# Altium project SBC5.PrjPcb (part 4 of 6)

## Sheet USB.SchDoc
size C; DocumentNumber: 6; SheetNumber: 6; SheetTotal: 13
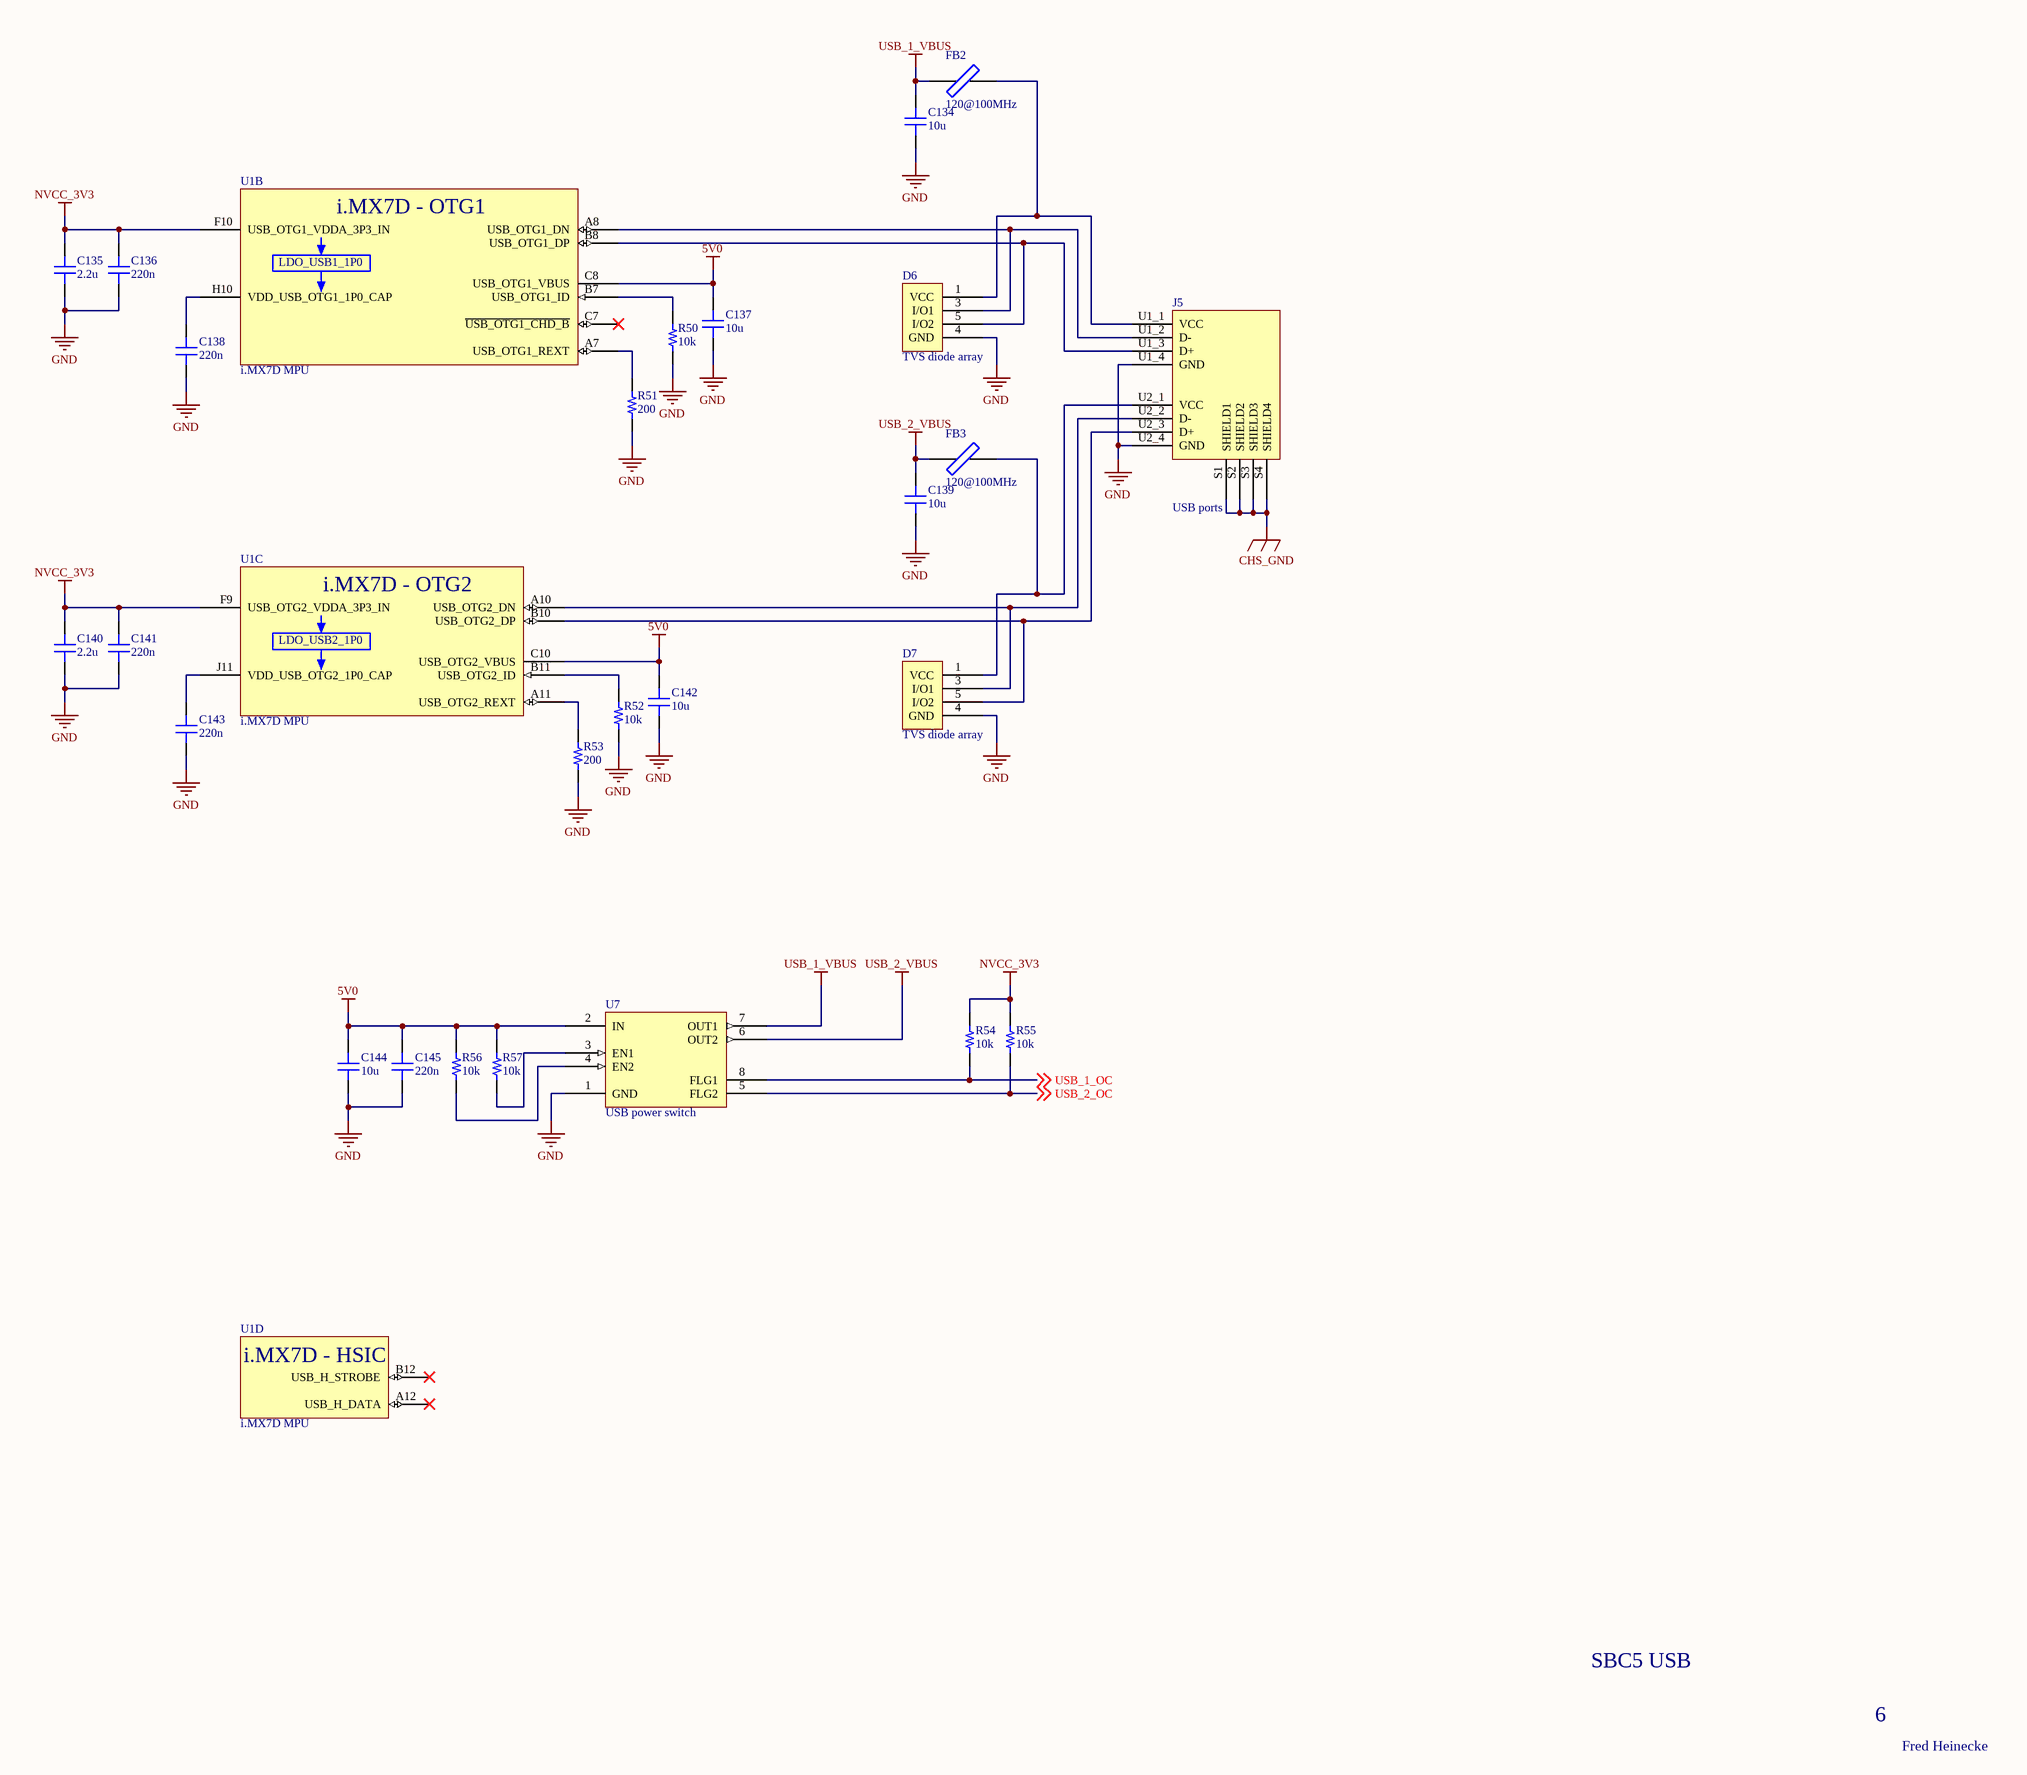
[diagram p8: USB.SchDoc]

### Parts
C134  10u  [C0805]
C135  2.2u  [C0402]
C136  220n  [C0201]
C137  10u  [C0805]
C138  220n  [C0201]
C139  10u  [C0805]
C140  2.2u  [C0402]
C141  220n  [C0201]
C142  10u  [C0805]
C143  220n  [C0201]
C144  10u  [C0805]
C145  220n  [C0201]
D6  TVS diode array  [TPD2E001DRLR]
D7  TVS diode array  [TPD2E001DRLR]
FB2  120@100MHz  [L0402]
FB3  120@100MHz  [L0402]
J5  USB ports  [UJ2-ADH-1-TH]
R50  10k  [R0201]
R51  200  [R0402]
R52  10k  [R0201]
R53  200  [R0402]
R54  10k  [R0201]
R55  10k  [R0201]
R56  10k  [R0201]
R57  10k  [R0201]
U1  i.MX7D MPU  [BGA541C75P25X25_1900X1900X140]  (parts B,C,D of 23)
U7  USB power switch  [SO-8]

### Nets
5V0: C137.2 C142.2 C144.2 C145.2 R56.2 R57.2 U1.C8(USB_OTG1_VBUS) U1.C10(USB_OTG2_VBUS) U7.2(IN)
CHS_GND: J5.S1(SHIELD1) J5.S2(SHIELD2) J5.S3(SHIELD3) J5.S4(SHIELD4)
GND: C134.1 C135.1 C136.1 C137.1 C138.1 C139.1 C140.1 C141.1 C142.1 C143.1 C144.1 C145.1 D6.4(GND) D7.4(GND) J5.U1_4(GND) J5.U2_4(GND) R50.1 R51.1 R52.1 R53.1 U7.1(GND)
NVCC_3V3: C135.2 C136.2 C140.2 C141.2 R54.2 R55.2 U1.F9(USB_OTG2_VDDA_3P3_IN) U1.F10(USB_OTG1_VDDA_3P3_IN)
USB_1_VBUS: C134.2 FB2.1 U7.7(OUT1)
USB_2_VBUS: C139.2 FB3.1 U7.6(OUT2)
USB_1_OC: R54.1 U7.8(FLG1) ; off-sheet USB_1_OC
USB_2_OC: R55.1 U7.5(FLG2) ; off-sheet USB_2_OC
NetC138_2: C138.2 U1.H10(VDD_USB_OTG1_1P0_CAP)
NetC143_2: C143.2 U1.J11(VDD_USB_OTG2_1P0_CAP)
NetD6_1: D6.1(VCC) FB2.2 J5.U1_1(VCC)
NetD6_3: D6.3(I/O1) J5.U1_2(D-) U1.A8(USB_OTG1_DN)
NetD6_5: D6.5(I/O2) J5.U1_3(D+) U1.B8(USB_OTG1_DP)
NetD7_1: D7.1(VCC) FB3.2 J5.U2_1(VCC)
NetD7_3: D7.3(I/O1) J5.U2_2(D-) U1.A10(USB_OTG2_DN)
NetD7_5: D7.5(I/O2) J5.U2_3(D+) U1.B10(USB_OTG2_DP)
NetR50_2: R50.2 U1.B7(USB_OTG1_ID)
NetR51_2: R51.2 U1.A7(USB_OTG1_REXT)
NetR52_2: R52.2 U1.B11(USB_OTG2_ID)
NetR53_2: R53.2 U1.A11(USB_OTG2_REXT)
NetR56_1: R56.1 U7.4(EN2)
NetR57_1: R57.1 U7.3(EN1)

Not connected (* = marked no-connect by the designer): U1 A12(USB_H_DATA)* B12(USB_H_STROBE)* C7(~{USB_OTG1_CHD_B})*

### Notes on the sheet
- SBC5 USB
- 6
- Fred Heinecke
- (in symbol MCIMX7D2DVM12SD, part B) i.MX7D - OTG1; LDO_USB1_1P0
- (in symbol MCIMX7D2DVM12SD, part C) i.MX7D - OTG2; LDO_USB2_1P0
- (in symbol MCIMX7D2DVM12SD, part D) i.MX7D - HSIC

### Library data of the parts
C134 C137 C139 C142 C144 = CL21A106KOQNNNE: SAMSUNG ELECTRO-MECHANICS - CL21A106KOQNNNE - SMD Multilayer Ceramic Capacitor, 10 µF, 16 V, 0805 [2012 Metric], ± 10%, X5R, CL Series; Capacitance: 10uF; Voltage Rating: 16V; Dielectric: X7R; Supplier 1: Digi-Key; Supplier Part Number 1: 1276-1096-1-ND; Manufacturer: Samsung; Manufacturer Part Number: CL21A106KOQNNNE; RoHS: Yes; Category: Ceramic Capacitors; Stock 1: 1393610; Pricing 1: 1=0.12000, 10=0.09000, 50=0.04900, 100=0.04000, 500=0.02860, 1000=0.02248 (USD); Mount: Surface Mount; Case/Package: 0805; Case Code (Metric): 2012; Case Code (Imperial): 0805; Min Operating Temperature: -55°C; Max Operating Temperature: 85°C; Package Quantity: 1; Packaging: Tape and Reel; Tolerance: 10%; Voltage Rating (DC): 16V; Series: CL; Construction: Flat; Voltage: 16V; Length: 2mm; Width: 0.049inch; Height: 1.25mm; Thickness: 0.055inch; Depth: 1.25mm; Radiation Hardening: No; Lead Free: Lead Free; RoHS Compliant: Yes; ComponentLink1URL: https://datasheet.ciiva.com/15216/getdatasheetpartid-358435-15216234.pdf?src-supplier=Verical; ComponentLink1Description: https://datasheet.ciiva.com/15216/getdatasheetpartid-358435-15216234.pdf?src-supplier=Verical; ComponentLink2URL: https://datasheet.ciiva.com/25798/cl21a106koqnnne-25798133.pdf?src-supplier=Digi-Key; ComponentLink2Description: https://datasheet.ciiva.com/25798/cl21a106koqnnne-25798133.pdf?src-supplier=Digi-Key; ComponentLink3URL: https://datasheet.ciiva.com/16740/cl05b104kq5nnnc-16740697.pdf?src-supplier=Future+Electronics; ComponentLink3Description: https://datasheet.ciiva.com/16740/cl05b104kq5nnnc-16740697.pdf?src-supplier=Future+Electronics
C135 C140 = LMK105BJ225MV-F: TAIYO YUDEN         LMK105BJ225MV-F            CERAMIC CAPACITOR, 2.2UF, 10V, X5R, 20%, 0402; Supplier 1: Digi-Key; Manufacturer: Taiyo Yuden; Manufacturer Part Number: LMK105BJ225MV-F; RoHS: Yes; Category: Ceramic Capacitors; Stock 1: 422093; Pricing 1: 1=0.10000, 10=0.05800, 50=0.03160, 100=0.02590, 500=0.01848, 1000=0.01452, 2500=0.01320, 5000=0.01214 (USD); Mount: Surface Mount; Case/Package: 0402; Case Code (Imperial): 0402; Case Code (Metric): 1005; Min Operating Temperature: -55°C; Max Operating Temperature: 85°C; Termination: SMD/SMT; Packaging: Tape and Reel; Capacitance: 2.2uF; Tolerance: 20%; Voltage Rating: 10V; Package Quantity: 1; Voltage Rating (DC): 10V; Dielectric: X5R; Resistor Type: Ceramic; Length: 1mm; Width: 0.5mm; Height: 0.5mm; Thickness: 0.022inch; Depth: 0.5mm; Radiation Hardening: No; Halogen Free: Halogen Free; REACH SVHC: Unknown; ComponentLink1URL: https://datasheet.ciiva.com/30190/500lmk105bj225mv-f-30190498.pdf?src-supplier=Onlinecomponents.com; ComponentLink1Description: https://datasheet.ciiva.com/30190/500lmk105bj225mv-f-30190498.pdf?src-supplier=Onlinecomponents.com; ComponentLink2URL: https://datasheet.ciiva.com/23631/lmk105bj225mv-f-ss-23631491.pdf?src-supplier=Newark; ComponentLink2Description: https://datasheet.ciiva.com/23631/lmk105bj225mv-f-ss-23631491.pdf?src-supplier=Newark; ComponentLink3URL: https://datasheet.ciiva.com/134/lmk105bj225mv-f-ss-134677.pdf?src-supplier=Digi-Key; ComponentLink3Description: https://datasheet.ciiva.com/134/lmk105bj225mv-f-ss-134677.pdf?src-supplier=Digi-Key; ComponentLink4URL: https://datasheet.ciiva.com/15921/286lmk105bj225mv-f-15921222.pdf?src-supplier=Onlinecomponents.com; ComponentLink4Description: https://datasheet.ciiva.com/15921/286lmk105bj225mv-f-15921222.pdf?src-supplier=Onlinecomponents.com; Supplier Part Number 1: 587-3153-1-ND
C136 C138 C141 C143 C145 = GRM033R61C224KE14D: Cap Ceramic Monolithic 0.22uF 16VDC 10% SMD Paper T/R; Manufacturer: Murata; Supplier 1: Digi-Key; Manufacturer Part Number: GRM033R61C224KE14D; RoHS: No; Stock 1: 16192; Pricing 1: 1=0.10000, 10=0.03900, 50=0.02120, 100=0.01720, 500=0.01232, 1000=0.00968, 2500=0.00880, 5000=0.00810 (USD); ComponentLink1URL: https://search.murata.co.jp/Ceramy/image/img/A01X/G101/ENG/GRM033R61C224KE14-01.pdf?src-supplier=Digi-Key; ComponentLink1Description: https://search.murata.co.jp/Ceramy/image/img/A01X/G101/ENG/GRM033R61C224KE14-01.pdf?src-supplier=Digi-Key; Supplier Part Number 1: 490-17040-1-ND
D6 D7 = TPD2E001DRLR: TEXAS INSTRUMENTS - TPD2E001DRLR - ESD Protection Device, 105.5 V, SOT, 5 Pins, 5.5 V, TPD2E Series; Direction: Unidirectional; Capacitance: 1.5pF; Number of Channels: 2; Breakdown Voltage: 11V; Clamping Voltage: 105.5V; Reverse Standoff Voltage: 5.5V; Power Line Protection: Yes; Leakage Current: 1nA; Element Configuration: Dual; Interface: LVDS,USB,Ethernet; Min Supply Voltage: 900mV; Peak Pulse Current: 10A; Supplier 1: Digi-Key; Supplier Part Number 1: 296-21883-1-ND; Manufacturer: Texas Instruments; Manufacturer Part Number: TPD2E001DRLR; RoHS: Yes; Category: Interface ICs; Stock 1: 42050; Pricing 1: 1=0.56000, 10=0.47900, 100=0.33280, 500=0.26880 (USD); Case/Package: SOT; Number of Pins: 5; Weight: 9.9E-05oz; Contact Plating: Gold; Min Operating Temperature: -40°C; Max Operating Temperature: 85°C; Package Quantity: 1; Polarity: Unidirectional; Packaging: Tape and Reel; Number of Bidirectional Channels: 2; Min Breakdown Voltage: 11V; Max Supply Voltage: 5.5V; Termination: SMD/SMT; Working Voltage: 5.5V; Length: 1.6mm; Width: 1.2mm; Height: 0.55mm; Depth: 1.2mm; Radiation Hardening: No; Lead Free: Lead Free; REACH SVHC: No SVHC; ComponentLink1URL: https://datasheet.ciiva.com/4479/slls684f-121568-4479427.pdf?src-supplier=Mouser; ComponentLink1Description: https://datasheet.ciiva.com/4479/slls684f-121568-4479427.pdf?src-supplier=Mouser; ComponentLink2URL: https://datasheet.ciiva.com/15134/getdatasheetpartid-186217-15134447.pdf?src-supplier=Verical; ComponentLink2Description: https://datasheet.ciiva.com/15134/getdatasheetpartid-186217-15134447.pdf?src-supplier=Verical; ComponentLink3URL: https://datasheet.ciiva.com/25955/tpd2e001-25955782.pdf?src-supplier=Avnet+Europe; ComponentLink3Description: https://datasheet.ciiva.com/25955/tpd2e001-25955782.pdf?src-supplier=Avnet+Europe; ComponentLink4URL: https://datasheet.ciiva.com/338/tpd2e001-338329.pdf?src-supplier=Digi-Key; ComponentLink4Description: https://datasheet.ciiva.com/338/tpd2e001-338329.pdf?src-supplier=Digi-Key; ComponentLink5URL: https://datasheet.ciiva.com/7650/1851973-7650906.pdf?src-supplier=Element14; ComponentLink5Description: https://datasheet.ciiva.com/7650/1851973-7650906.pdf?src-supplier=Element14; ComponentLink6URL: https://datasheet.ciiva.com/14423/tpd2e001-14423679.pdf?src-supplier=Avnet; ComponentLink6Description: https://datasheet.ciiva.com/14423/tpd2e001-14423679.pdf?src-supplier=Avnet; ComponentLink7URL: https://datasheet.ciiva.com/16476/tpd2e001-16476822.pdf?src-supplier=Avnet+Asia; ComponentLink7Description: https://datasheet.ciiva.com/16476/tpd2e001-16476822.pdf?src-supplier=Avnet+Asia; ComponentLink8URL: https://datasheet.ciiva.com/338/tpd2e001-338328.pdf?src-supplier=Digi-Key; ComponentLink8Description: https://datasheet.ciiva.com/338/tpd2e001-338328.pdf?src-supplier=Digi-Key; ComponentLink9URL: https://datasheet.ciiva.com/338/tpd2e001-338330.pdf?src-supplier=Digi-Key; ComponentLink9Description: https://datasheet.ciiva.com/338/tpd2e001-338330.pdf?src-supplier=Digi-Key; Supplier 2: Arrow Electronics; Supplier Part Number 2: TPD2E001DRLR; Supplier 3: Mouser; Supplier Part Number 3: 595-TPD2E001DRLR
FB2 FB3 = BLM15PD121SN1D: MURATA - BLM15PD121SN1D - Ferrite Bead, 0402 [1005 Metric], 120 ohm, 1.3 A, BLM15PD Series, 0.09 ohm, ± 25%; Material: Steel,Ferrite; Impedance: 120R; DC Resistance (DCR): 90mR; Max DC Current: 1.3A; Number of Lines: 1; Test Frequency: 100MHz; Supplier 1: Digi-Key; Supplier Part Number 1: 490-5203-1-ND; Manufacturer: Murata; Manufacturer Part Number: BLM15PD121SN1D; RoHS: Yes; Category: Inductors; Stock 1: 519984; Pricing 1: 1=0.10000, 10=0.07900, 25=0.07080, 50=0.05180, 100=0.04480, 250=0.03536, 500=0.02984, 1000=0.02514, 5000=0.02239 (USD); Case/Package: 0402; Number of Pins: 2; Core Material: Ferrite; Case Code (Metric): 1005; Case Code (Imperial): 0402; Min Operating Temperature: -55°C; Max Operating Temperature: 125°C; Tolerance: 25%; Package Quantity: 1; Packaging: Tape and Reel; Current Rating: 1.3A; Max Current Rating: 1.3A; Termination: SMD/SMT; DC Current: 1.3A; Number of Circuits: 1; Series: BLM15PD; DC Resistance-Max: 90mR; Length: 1mm; Width: 0.5mm; Height: 0.5mm; Depth: 0.55mm; Radiation Hardening: No; REACH SVHC: No SVHC; Military Standard: Not; Lead Free: Lead Free; RoHS Compliant: Yes; ComponentLink1URL: https://datasheet.ciiva.com/18093/getdatasheetpartid-195858-18093157.pdf?src-supplier=Verical; ComponentLink1Description: https://datasheet.ciiva.com/18093/getdatasheetpartid-195858-18093157.pdf?src-supplier=Verical; ComponentLink2URL: https://datasheet.ciiva.com/11800/0900766b811b5866-11800860.pdf?src-supplier=RSComponents; ComponentLink2Description: https://datasheet.ciiva.com/11800/0900766b811b5866-11800860.pdf?src-supplier=RSComponents; ComponentLink3URL: https://datasheet.ciiva.com/41425/001171686-da-01-en-chip-drossel0402-120r-1300ma-1-0x0-5mm-41425776.pdf?src-supplier=Conrad; ComponentLink3Description: https://datasheet.ciiva.com/41425/001171686-da-01-en-chip-drossel0402-120r-1300ma-1-0x0-5mm-41425776.pdf?src-supplier=Conrad; ComponentLink4URL: https://datasheet.ciiva.com/41449/001172205-da-01-en-drossel-0402-120r-11-0x0-5mm-10000st-41449495.pdf?src-supplier=Conrad; ComponentLink4Description: https://datasheet.ciiva.com/41449/001172205-da-01-en-drossel-0402-120r-11-0x0-5mm-10000st-41449495.pdf?src-supplier=Conrad; ComponentLink5URL: https://datasheet.ciiva.com/1012/l0110e-1012434.pdf?src-supplier=Digi-Key; ComponentLink5Description: https://datasheet.ciiva.com/1012/l0110e-1012434.pdf?src-supplier=Digi-Key; ComponentLink6URL: https://datasheet.ciiva.com/1012/l0110e-1012435.pdf?src-supplier=Digi-Key; ComponentLink6Description: https://datasheet.ciiva.com/1012/l0110e-1012435.pdf?src-supplier=Digi-Key; ComponentLink7URL: https://datasheet.ciiva.com/1012/l0110e-1012436.pdf?src-supplier=Digi-Key; ComponentLink7Description: https://datasheet.ciiva.com/1012/l0110e-1012436.pdf?src-supplier=Digi-Key
J5 = UJ2-ADH-1-TH: CONN RCPT USB2.0 TYPEA STACK R/A; Manufacturer: CUI; Connector Type: Jack; Number of Contacts: 8; Gender: Receptacle; Supplier 1: Digi-Key; Supplier Part Number 1: 102-4001-ND; Manufacturer Part Number: UJ2-ADH-1-TH; RoHS: No; Category: Connectors; Stock 1: 1615; Pricing 1: 1=0.95000, 10=0.83100, 25=0.78240, 50=0.74980, 130=0.71723, 260=0.65200, 520=0.58681, 1040=0.52160, 2600=0.47270 (USD); Mount: Through Hole,Horizontal; Number of Pins: 8; Features: Shielded; Packaging: Tray; Orientation: Horizontal; Lead Free: Lead Free; ComponentLink1URL: https://www.cui.com/product/resource/digikeypdf/uj2-adh-th.pdf?src-supplier=Mouser; ComponentLink1Description: https://www.cui.com/product/resource/digikeypdf/uj2-adh-th.pdf?src-supplier=Mouser; ComponentLink2URL: https://www.cui.com/product/resource/digikeypdf/uj2-adh-th.pdf?src-supplier=Verical; ComponentLink2Description: https://www.cui.com/product/resource/digikeypdf/uj2-adh-th.pdf?src-supplier=Verical; ComponentLink3URL: https://www.cui.com/product/resource/digikeypdf/uj2-adh-th.pdf?src-supplier=Onlinecomponents.com; ComponentLink3Description: https://www.cui.com/product/resource/digikeypdf/uj2-adh-th.pdf?src-supplier=Onlinecomponents.com; ComponentLink4URL: https://www.cui.com/product/resource/digikeypdf/uj2-adh-th.pdf?src-supplier=Digi-Key; ComponentLink4Description: https://www.cui.com/product/resource/digikeypdf/uj2-adh-th.pdf?src-supplier=Digi-Key; ComponentLink5URL: https://www.cui.com/product/resource/digikeypdf/uj2-adh-th.pdf?src-supplier=Arrow+Electronics; ComponentLink5Description: https://www.cui.com/product/resource/digikeypdf/uj2-adh-th.pdf?src-supplier=Arrow+Electronics; ComponentLink6URL: https://www.cui.com/product/resource/digikeypdf/uj2-adh-th.pdf?src-supplier=Electro+Sonic; ComponentLink6Description: https://www.cui.com/product/resource/digikeypdf/uj2-adh-th.pdf?src-supplier=Electro+Sonic; ComponentLink7URL: https://www.cui.com/product/resource/digikeypdf/uj2-adh-th.pdf?src-supplier=NAC+Semi; ComponentLink7Description: https://www.cui.com/product/resource/digikeypdf/uj2-adh-th.pdf?src-supplier=NAC+Semi
R50 R52 R54-R57 = RMCF0201FT10K0: RES 10K OHM 1% 1/20W 0201; Manufacturer: Stackpole Electronics; Max Power Dissipation: 50mW; Temperature Coefficient: 200ppm/°C; Resistance: 10kR; Supplier 1: Digi-Key; Manufacturer Part Number: RMCF0201FT10K0; RoHS: Yes; Category: Chip SMD Resistors; Stock 1: 1526173; Pricing 1: 1=0.10000, 10=0.02300, 100=0.00940, 1000=0.00424, 2500=0.00368, 5000=0.00304 (USD); Mount: Surface Mount; Case/Package: 0201; Contact Plating: Tin,Matte; Case Code (Imperial): 0201; Case Code (Metric): 0603; Min Operating Temperature: -55°C; Max Operating Temperature: 125°C; Resistor Type: Thick Film; Number of Terminations: 2; Packaging: Tape and Reel; Tolerance: 1%; Power Rating: 50mW; Length: 0.024inch; Width: 0.012inch; Height: 0.009inch; ComponentLink1URL: https://www.seielect.com/catalog/SEI-Packaging.pdf?src-supplier=Digi-Key; ComponentLink1Description: https://www.seielect.com/catalog/SEI-Packaging.pdf?src-supplier=Digi-Key; ComponentLink2URL: https://www.seielect.com/Catalog/SEI-RMCF_RMCP.pdf?src-supplier=Avnet+Asia; ComponentLink2Description: https://www.seielect.com/Catalog/SEI-RMCF_RMCP.pdf?src-supplier=Avnet+Asia; ComponentLink3URL: https://www.seielect.com/Catalog/SEI-RMCF_RMCP.pdf?src-supplier=Avnet; ComponentLink3Description: https://www.seielect.com/Catalog/SEI-RMCF_RMCP.pdf?src-supplier=Avnet; ComponentLink4URL: https://www.seielect.com/Catalog/SEI-RMCF_RMCP.pdf?src-supplier=Digi-Key; ComponentLink4Description: https://www.seielect.com/Catalog/SEI-RMCF_RMCP.pdf?src-supplier=Digi-Key; Supplier Part Number 1: RMCF0201FT10K0CT-ND
R51 R53 = ERJ-2RKF2000X: Res Thick Film 0402 200 Ohm 1% 1/10W ±100ppm/°C Molded SMD Punched Carrier T/R; Manufacturer: Panasonic; Resistance: 200R; Power Rating: 100mW; Voltage Rating: 50V; Supplier 1: Digi-Key; Supplier Part Number 1: P200LCT-ND; Manufacturer Part Number: ERJ-2RKF2000X; RoHS: Yes; Category: Chip SMD Resistors; Stock 1: 1029432; Pricing 1: 1=0.10000, 10=0.02200, 100=0.00890, 1000=0.00398, 2500=0.00345, 5000=0.00285 (USD); Mount: Surface Mount; Case/Package: 0402; Case Code (Metric): 1005; Case Code (Imperial): 0402; Contact Plating: Tin; Size Code: 0402; Min Operating Temperature: -55°C; Max Operating Temperature: 155°C; Tolerance: 1%; Packaging: Tape and Reel; Package Quantity: 1; Resistor Type: Thick Film; Number of Terminations: 2; Termination: SMD/SMT; Temperature Coefficient: 100ppm/°C; Max Power Dissipation: 100mW; Voltage Rating (DC): 50V; Features: Automotive AEC-Q200; Series: ERJ; Technology: THICK FILM; Resistance Tolerance: 1%; Construction: Rectangular; Length: 1mm; Width: 0.02inch; Height: 0.35mm; Depth: 0.5mm; Radiation Hardening: No; REACH SVHC: No SVHC; Military Standard: Not; Lead Free: Lead Free; RoHS Compliant: Yes; ComponentLink1URL: https://datasheet.ciiva.com/11821/0900766b80f80784-11821222.pdf?src-supplier=RSComponents; ComponentLink1Description: https://datasheet.ciiva.com/11821/0900766b80f80784-11821222.pdf?src-supplier=RSComponents; ComponentLink2URL: https://datasheet.ciiva.com/16449/aoa0000ce2-16449365.pdf?src-supplier=Future+Electronics; ComponentLink2Description: https://datasheet.ciiva.com/16449/aoa0000ce2-16449365.pdf?src-supplier=Future+Electronics; ComponentLink3URL: https://datasheet.ciiva.com/48531/aoa0000ce2-48531061.pdf?src-supplier=Avnet; ComponentLink3Description: https://datasheet.ciiva.com/48531/aoa0000ce2-48531061.pdf?src-supplier=Avnet; ComponentLink4URL: https://datasheet.ciiva.com/22748/426256-22748294.pdf?src-supplier=Element14; ComponentLink4Description: https://datasheet.ciiva.com/22748/426256-22748294.pdf?src-supplier=Element14; ComponentLink5URL: https://datasheet.ciiva.com/28691/1678782-28691926.pdf?src-supplier=Element14; ComponentLink5Description: https://datasheet.ciiva.com/28691/1678782-28691926.pdf?src-supplier=Element14; ComponentLink6URL: https://datasheet.ciiva.com/6137/426256-6137544.pdf?src-supplier=Farnell; ComponentLink6Description: https://datasheet.ciiva.com/6137/426256-6137544.pdf?src-supplier=Farnell; ComponentLink7URL: https://datasheet.ciiva.com/22748/426256-22748296.pdf?src-supplier=Element14; ComponentLink7Description: https://datasheet.ciiva.com/22748/426256-22748296.pdf?src-supplier=Element14; ComponentLink8URL: https://datasheet.ciiva.com/43460/426256-43460283.pdf?src-supplier=Farnell; ComponentLink8Description: https://datasheet.ciiva.com/43460/426256-43460283.pdf?src-supplier=Farnell; ComponentLink9URL: https://datasheet.ciiva.com/24024/aoa0000ce2-24024252.pdf?src-supplier=Mouser; ComponentLink9Description: https://datasheet.ciiva.com/24024/aoa0000ce2-24024252.pdf?src-supplier=Mouser; ComponentLink10URL: https://datasheet.ciiva.com/9184/aoa0000ce2-9184574.pdf?src-supplier=Avnet; ComponentLink10Description: https://datasheet.ciiva.com/9184/aoa0000ce2-9184574.pdf?src-supplier=Avnet; ComponentLink11URL: https://datasheet.ciiva.com/16758/70260748-16758862.pdf?src-supplier=Allied+Electronics; ComponentLink11Description: https://datasheet.ciiva.com/16758/70260748-16758862.pdf?src-supplier=Allied+Electronics; ComponentLink12URL: https://datasheet.ciiva.com/22749/1678782-22749583.pdf?src-supplier=Element14; ComponentLink12Description: https://datasheet.ciiva.com/22749/1678782-22749583.pdf?src-supplier=Element14; ComponentLink13URL: https://datasheet.ciiva.com/30174/aoa0000ce2-30174431.pdf?src-supplier=Onlinecomponents.com; ComponentLink13Description: https://datasheet.ciiva.com/30174/aoa0000ce2-30174431.pdf?src-supplier=Onlinecomponents.com
U1 = MCIMX7D2DVM12SD: Heterogeneous Multicore Processing Architecture; Manufacturer: NXP Freescale; Manufacturer Part Number: MCIMX7D2DVM12SD; Stock 1: 0; Pricing 1: 168=18.42238 (USD); ComponentLink1Description: Datasheet; ComponentLink1URL: https://www.nxp.com/docs/en/data-sheet/IMX7DCEC.pdf; ComponentLink2Description: Reference manual; ComponentLink2URL: https://www.nxp.com/docs/en/reference-manual/IMX7DRM.pdf; ComponentLink3Description: Hardware Development Guide; ComponentLink3URL: https://www.nxp.com/docs/en/user-guide/IMX7DSHDG.pdf; Supplier 1: Digi-Key; Supplier Part Number 1: 568-15401-ND
U7 = AP2152SG-13: IC PWR SW USB 2CH 0.5A 8-SOIC; Manufacturer: Diodes; Number of Outputs: 2; Current Rating: 800mA; Max Supply Voltage: 5.5V; Min Supply Voltage: 2.7V; Interface: On/Off; Max Output Current: 500mA; On-State Resistance: 150mR; Fault Protection: Over Temperature,Reverse Current; Output Configuration: High Side; On-state Resistance-Max: 160MR; Supplier 1: Digi-Key; Supplier Part Number 1: AP2152SGDICT-ND; Manufacturer Part Number: AP2152SG-13; RoHS: Yes; Category: Hot Swap Controllers; Stock 1: 9416; Pricing 1: 1=0.48000, 10=0.41200, 25=0.38480, 100=0.28600, 250=0.24200, 500=0.23100 (USD); Mount: Surface Mount; Case/Package: SOP; Number of Pins: 8; Weight: 0.00261oz; Min Operating Temperature: -40°C; Max Operating Temperature: 85°C; Packaging: Tape and Reel; Package Quantity: 2500; Series: -; Number of Switches: 2; Rated Current-Max: 800mA; Radiation Hardening: No; Lead Free: Lead Free; RoHS Compliant: Yes; ComponentLink1URL: https://datasheet.ciiva.com/15108/getdatasheetpartid-687500-15108893.pdf?src-supplier=Verical; ComponentLink1Description: https://datasheet.ciiva.com/15108/getdatasheetpartid-687500-15108893.pdf?src-supplier=Verical; ComponentLink2URL: https://datasheet.ciiva.com/16415/ap2142-52-16415693.pdf?src-supplier=Future+Electronics; ComponentLink2Description: https://datasheet.ciiva.com/16415/ap2142-52-16415693.pdf?src-supplier=Future+Electronics; ComponentLink3URL: https://datasheet.ciiva.com/4924/ap2142-52-4924670.pdf?src-supplier=Mouser; ComponentLink3Description: https://datasheet.ciiva.com/4924/ap2142-52-4924670.pdf?src-supplier=Mouser; ComponentLink4URL: https://datasheet.ciiva.com/17226/ap2142-52-17226168.pdf?src-supplier=Avnet+Europe; ComponentLink4Description: https://datasheet.ciiva.com/17226/ap2142-52-17226168.pdf?src-supplier=Avnet+Europe; ComponentLink5URL: https://datasheet.ciiva.com/3234/ap2142-52-3234540.pdf?src-supplier=Avnet; ComponentLink5Description: https://datasheet.ciiva.com/3234/ap2142-52-3234540.pdf?src-supplier=Avnet

## Sheet SD.SchDoc
size A; DocumentNumber: 7; SheetNumber: 7; SheetTotal: 13
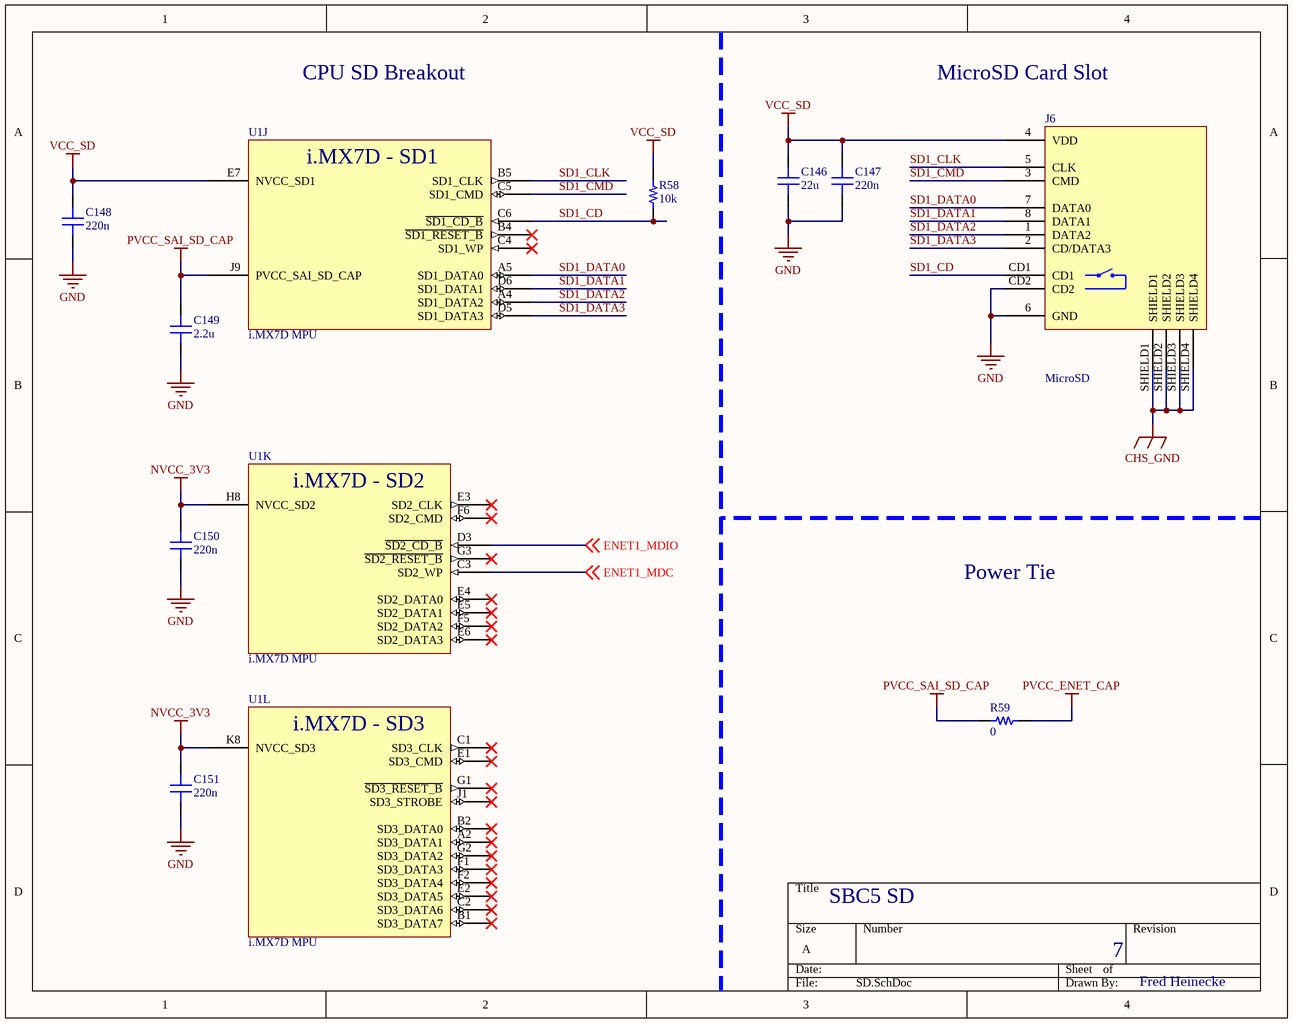
[diagram p9: SD.SchDoc]

### Parts
C146  22u  [C0603]
C147  220n  [C0201]
C148  220n  [C0201]
C149  2.2u  [C0402]
C150  220n  [C0201]
C151  220n  [C0201]
J6  MicroSD  [114-00841-68]
R58  10k  [R0201]
R59  0  [R0402]
U1  i.MX7D MPU  [BGA541C75P25X25_1900X1900X140]  (parts J,K,L of 23)

### Nets
CHS_GND: J6.SHIELD1 J6.SHIELD2 J6.SHIELD3 J6.SHIELD4
GND: C146.1 C147.1 C148.1 C149.1 C150.1 C151.1 J6.6(GND) J6.CD2
NVCC_3V3: C150.2 C151.2 U1.H8(NVCC_SD2) U1.K8(NVCC_SD3)
PVCC_ENET_CAP: R59.2
PVCC_SAI_SD_CAP: C149.2 R59.1 U1.J9(PVCC_SAI_SD_CAP)
VCC_SD: C146.2 C147.2 C148.2 J6.4(VDD) R58.2 U1.E7(NVCC_SD1)
ENET1_MDC: U1.C3(SD2_WP) ; off-sheet ENET1_MDC
ENET1_MDIO: U1.D3(~{SD2_CD_B}) ; off-sheet ENET1_MDIO
SD1_CD: J6.CD1 R58.1 U1.C6(~{SD1_CD_B})
SD1_CLK: J6.5(CLK) U1.B5(SD1_CLK)
SD1_CMD: J6.3(CMD) U1.C5(SD1_CMD)
SD1_DATA0: J6.7(DATA0) U1.A5(SD1_DATA0)
SD1_DATA1: J6.8(DATA1) U1.D6(SD1_DATA1)
SD1_DATA2: J6.1(DATA2) U1.A4(SD1_DATA2)
SD1_DATA3: J6.2(CD/DATA3) U1.D5(SD1_DATA3)

Not connected (* = marked no-connect by the designer): U1 A2(SD3_DATA1)* B1(SD3_DATA7)* B2(SD3_DATA0)* B4(~{SD1_RESET_B})* C1(SD3_CLK)* C2(SD3_DATA6)* C4(SD1_WP)* E1(SD3_CMD)* E2(SD3_DATA5)* E3(SD2_CLK)* E4(SD2_DATA0)* E5(SD2_DATA1)* E6(SD2_DATA3)* F1(SD3_DATA3)* F2(SD3_DATA4)* F5(SD2_DATA2)* F6(SD2_CMD)* G1(~{SD3_RESET_B})* G2(SD3_DATA2)* G3(~{SD2_RESET_B})* J1(SD3_STROBE)*

### Notes on the sheet
- CPU SD Breakout
- MicroSD Card Slot
- Power Tie
- SBC5 SD
- 7
- Fred Heinecke
- (in symbol MCIMX7D2DVM12SD, part J) i.MX7D - SD1
- (in symbol MCIMX7D2DVM12SD, part K) i.MX7D - SD2
- (in symbol MCIMX7D2DVM12SD, part L) i.MX7D - SD3

### Library data of the parts
C146 = GRM188R61A226ME15D: 0603 22 uF 10 V ±20% Tolerance X5R Multilayer Ceramic Chip Capacitor; Manufacturer: Murata; Capacitance: 22uF; Voltage Rating: 10V; Supplier 1: Digi-Key; Manufacturer Part Number: GRM188R61A226ME15D; RoHS: Yes; Category: Ceramic Capacitors; Stock 1: 1418007; Pricing 1: 1=0.30000, 10=0.20500, 50=0.13680, 100=0.11630, 500=0.08210, 1000=0.07184 (USD); Mount: Surface Mount; Case/Package: 0603; Case Code (Metric): 1608; Case Code (Imperial): 0603; Material: Ceramic; Weight: 0.000222oz; Min Operating Temperature: -55°C; Max Operating Temperature: 85°C; Tolerance: 20%; Packaging: Tape and Reel; Dielectric: X5R; Termination: SMD/SMT; Voltage Rating (DC): 10V; Package Quantity: 4000; Length: 1.6mm; Width: 0.8mm; Height: 0.8mm; Thickness: 0.039inch; Depth: 0.8mm; REACH SVHC: No SVHC; Lead Free: Lead Free; ComponentLink1URL: https://datasheet.ciiva.com/46444/1769893-46444975.pdf?src-supplier=Element14; ComponentLink1Description: https://datasheet.ciiva.com/46444/1769893-46444975.pdf?src-supplier=Element14; Supplier Part Number 1: 490-10476-1-ND
C147 C148 C150 C151 = GRM033R61C224KE14D: as C136 on sheet USB; Supplier 1: Digi-Key; Manufacturer Part Number: GRM033R61C224KE14D; RoHS: No; Stock 1: 16192; Pricing 1: 1=0.10000, 10=0.03900, 50=0.02120, 100=0.01720, 500=0.01232, 1000=0.00968, 2500=0.00880, 5000=0.00810 (USD); ComponentLink1URL: https://search.murata.co.jp/Ceramy/image/img/A01X/G101/ENG/GRM033R61C224KE14-01.pdf?src-supplier=Digi-Key; ComponentLink1Description: https://search.murata.co.jp/Ceramy/image/img/A01X/G101/ENG/GRM033R61C224KE14-01.pdf?src-supplier=Digi-Key; Supplier Part Number 1: 490-17040-1-ND
C149 = LMK105BJ225MV-F: as C135 on sheet USB; Supplier 1: Digi-Key; Manufacturer: Taiyo Yuden; Manufacturer Part Number: LMK105BJ225MV-F; RoHS: Yes; Category: Ceramic Capacitors; Stock 1: 422093; Pricing 1: 1=0.10000, 10=0.05800, 50=0.03160, 100=0.02590, 500=0.01848, 1000=0.01452, 2500=0.01320, 5000=0.01214 (USD); Mount: Surface Mount; Case/Package: 0402; Case Code (Imperial): 0402; Case Code (Metric): 1005; Min Operating Temperature: -55°C; Max Operating Temperature: 85°C; Termination: SMD/SMT; Packaging: Tape and Reel; Capacitance: 2.2uF; Tolerance: 20%; Voltage Rating: 10V; Package Quantity: 1; Voltage Rating (DC): 10V; Dielectric: X5R; Resistor Type: Ceramic; Length: 1mm; Width: 0.5mm; Height: 0.5mm; Thickness: 0.022inch; Depth: 0.5mm; Radiation Hardening: No; Halogen Free: Halogen Free; REACH SVHC: Unknown; ComponentLink1URL: https://datasheet.ciiva.com/30190/500lmk105bj225mv-f-30190498.pdf?src-supplier=Onlinecomponents.com; ComponentLink1Description: https://datasheet.ciiva.com/30190/500lmk105bj225mv-f-30190498.pdf?src-supplier=Onlinecomponents.com; ComponentLink2URL: https://datasheet.ciiva.com/23631/lmk105bj225mv-f-ss-23631491.pdf?src-supplier=Newark; ComponentLink2Description: https://datasheet.ciiva.com/23631/lmk105bj225mv-f-ss-23631491.pdf?src-supplier=Newark; ComponentLink3URL: https://datasheet.ciiva.com/134/lmk105bj225mv-f-ss-134677.pdf?src-supplier=Digi-Key; ComponentLink3Description: https://datasheet.ciiva.com/134/lmk105bj225mv-f-ss-134677.pdf?src-supplier=Digi-Key; ComponentLink4URL: https://datasheet.ciiva.com/15921/286lmk105bj225mv-f-15921222.pdf?src-supplier=Onlinecomponents.com; ComponentLink4Description: https://datasheet.ciiva.com/15921/286lmk105bj225mv-f-15921222.pdf?src-supplier=Onlinecomponents.com; Supplier Part Number 1: 587-3153-1-ND
J6 = 1140084168: Conn; IC Socket; Micro SD; Right Angle; PCB Mount; MicroSD Ser.; Manufacturer: Amphenol Commercial; Connector Type: Connector; Number of Contacts: 8; Gender: Receptacle; Pitch: 1.1mm; Supplier 1: Digi-Key; Supplier Part Number 1: 114-00841-68-1-ND; Manufacturer Part Number: 1140084168; RoHS: Yes; Category: Memory Connectors; Stock 1: 15252; Pricing 1: 1=1.26000, 10=1.14000, 25=1.07000, 50=1.02360, 100=0.97710, 250=0.88408, 500=0.81428 (USD); Mount: Surface Mount; Contact Plating: Gold; Housing Material: Polymer; Contact Material: Copper Alloy,Copper; Packaging: Tape and Reel; Orientation: Right Angle; Package Quantity: 7500; Number of Rows: 1; Termination: SMD/SMT; Length: 15.6mm; Height: 1.55mm; Depth: 11.45mm; Radiation Hardening: No; REACH SVHC: Unknown; Flammability Rating: UL94 V-0; Lead Free: Lead Free; ComponentLink1URL: https://datasheet.ciiva.com/24241/11400841-283410-24241569.pdf?src-supplier=Mouser; ComponentLink1Description: https://datasheet.ciiva.com/24241/11400841-283410-24241569.pdf?src-supplier=Mouser; ComponentLink2URL: https://datasheet.ciiva.com/28408/11400841-28408193.pdf?src-supplier=Element14; ComponentLink2Description: https://datasheet.ciiva.com/28408/11400841-28408193.pdf?src-supplier=Element14; ComponentLink3URL: https://datasheet.ciiva.com/9464/1140084168-9464901.pdf?src-supplier=Avnet; ComponentLink3Description: https://datasheet.ciiva.com/9464/1140084168-9464901.pdf?src-supplier=Avnet; ComponentLink4URL: https://datasheet.ciiva.com/48965/70323450-48965706.pdf?src-supplier=Allied+Electronics; ComponentLink4Description: https://datasheet.ciiva.com/48965/70323450-48965706.pdf?src-supplier=Allied+Electronics; ComponentLink5URL: https://datasheet.ciiva.com/16655/1140084168-16655293.pdf?src-supplier=Avnet+Europe; ComponentLink5Description: https://datasheet.ciiva.com/16655/1140084168-16655293.pdf?src-supplier=Avnet+Europe
R58 = RMCF0201FT10K0: as R50 on sheet USB; Supplier 1: Digi-Key; Manufacturer Part Number: RMCF0201FT10K0; RoHS: Yes; Category: Chip SMD Resistors; Stock 1: 1526173; Pricing 1: 1=0.10000, 10=0.02300, 100=0.00940, 1000=0.00424, 2500=0.00368, 5000=0.00304 (USD); Mount: Surface Mount; Case/Package: 0201; Contact Plating: Tin,Matte; Case Code (Imperial): 0201; Case Code (Metric): 0603; Min Operating Temperature: -55°C; Max Operating Temperature: 125°C; Resistor Type: Thick Film; Number of Terminations: 2; Packaging: Tape and Reel; Tolerance: 1%; Power Rating: 50mW; Length: 0.024inch; Width: 0.012inch; Height: 0.009inch; ComponentLink1URL: https://www.seielect.com/catalog/SEI-Packaging.pdf?src-supplier=Digi-Key; ComponentLink1Description: https://www.seielect.com/catalog/SEI-Packaging.pdf?src-supplier=Digi-Key; ComponentLink2URL: https://www.seielect.com/Catalog/SEI-RMCF_RMCP.pdf?src-supplier=Avnet+Asia; ComponentLink2Description: https://www.seielect.com/Catalog/SEI-RMCF_RMCP.pdf?src-supplier=Avnet+Asia; ComponentLink3URL: https://www.seielect.com/Catalog/SEI-RMCF_RMCP.pdf?src-supplier=Avnet; ComponentLink3Description: https://www.seielect.com/Catalog/SEI-RMCF_RMCP.pdf?src-supplier=Avnet; ComponentLink4URL: https://www.seielect.com/Catalog/SEI-RMCF_RMCP.pdf?src-supplier=Digi-Key; ComponentLink4Description: https://www.seielect.com/Catalog/SEI-RMCF_RMCP.pdf?src-supplier=Digi-Key; Supplier Part Number 1: RMCF0201FT10K0CT-ND
R59 = RMCF0402ZT0R00: RES 0 OHM JUMPER 1/16W 0402; Manufacturer: Stackpole Electronics; Resistance: 0R; Power Rating: 63mW; Current Rating: 1A; Working Voltage: 50V; Supplier 1: Digi-Key; Supplier Part Number 1: RMCF0402ZT0R00CT-ND; Manufacturer Part Number: RMCF0402ZT0R00; RoHS: Yes; Category: Chip SMD Resistors; Stock 1: 7645981; Pricing 1: 1=0.10000, 10=0.01000, 25=0.00720, 50=0.00560, 100=0.00410, 250=0.00316, 500=0.00252, 1000=0.00186, 5000=0.00133 (USD); Mount: Surface Mount; Case/Package: 0402; Case Code (Metric): 1005; Case Code (Imperial): 0402; Contact Plating: Tin,Matte; Min Operating Temperature: -55°C; Max Operating Temperature: 155°C; Packaging: Tape and Reel; Resistor Type: Thick Film; Number of Terminations: 2; Max Power Dissipation: 63mW; Features: Automotive AEC-Q200; Series: RMCF; Technology: THICK FILM; Construction: Rectangular; Length: 0.039inch; Width: 0.02inch; Height: 0.016inch; Depth: 0.5mm; Radiation Hardening: No; Military Standard: Not; Lead Free: Lead Free; RoHS Compliant: Yes; ComponentLink1URL: https://datasheet.ciiva.com/26835/getdatasheetpartid-409751-26835612.pdf?src-supplier=Verical; ComponentLink1Description: https://datasheet.ciiva.com/26835/getdatasheetpartid-409751-26835612.pdf?src-supplier=Verical
U1 = MCIMX7D2DVM12SD: as U1 on sheet USB; Manufacturer Part Number: MCIMX7D2DVM12SD; Stock 1: 0; Pricing 1: 168=18.42238 (USD); ComponentLink1Description: Datasheet; ComponentLink1URL: https://www.nxp.com/docs/en/data-sheet/IMX7DCEC.pdf; ComponentLink2Description: Reference manual; ComponentLink2URL: https://www.nxp.com/docs/en/reference-manual/IMX7DRM.pdf; ComponentLink3Description: Hardware Development Guide; ComponentLink3URL: https://www.nxp.com/docs/en/user-guide/IMX7DSHDG.pdf; Supplier 1: Digi-Key; Supplier Part Number 1: 568-15401-ND